# EAGLE design 03_HLT (EAGLE 7.5.0)
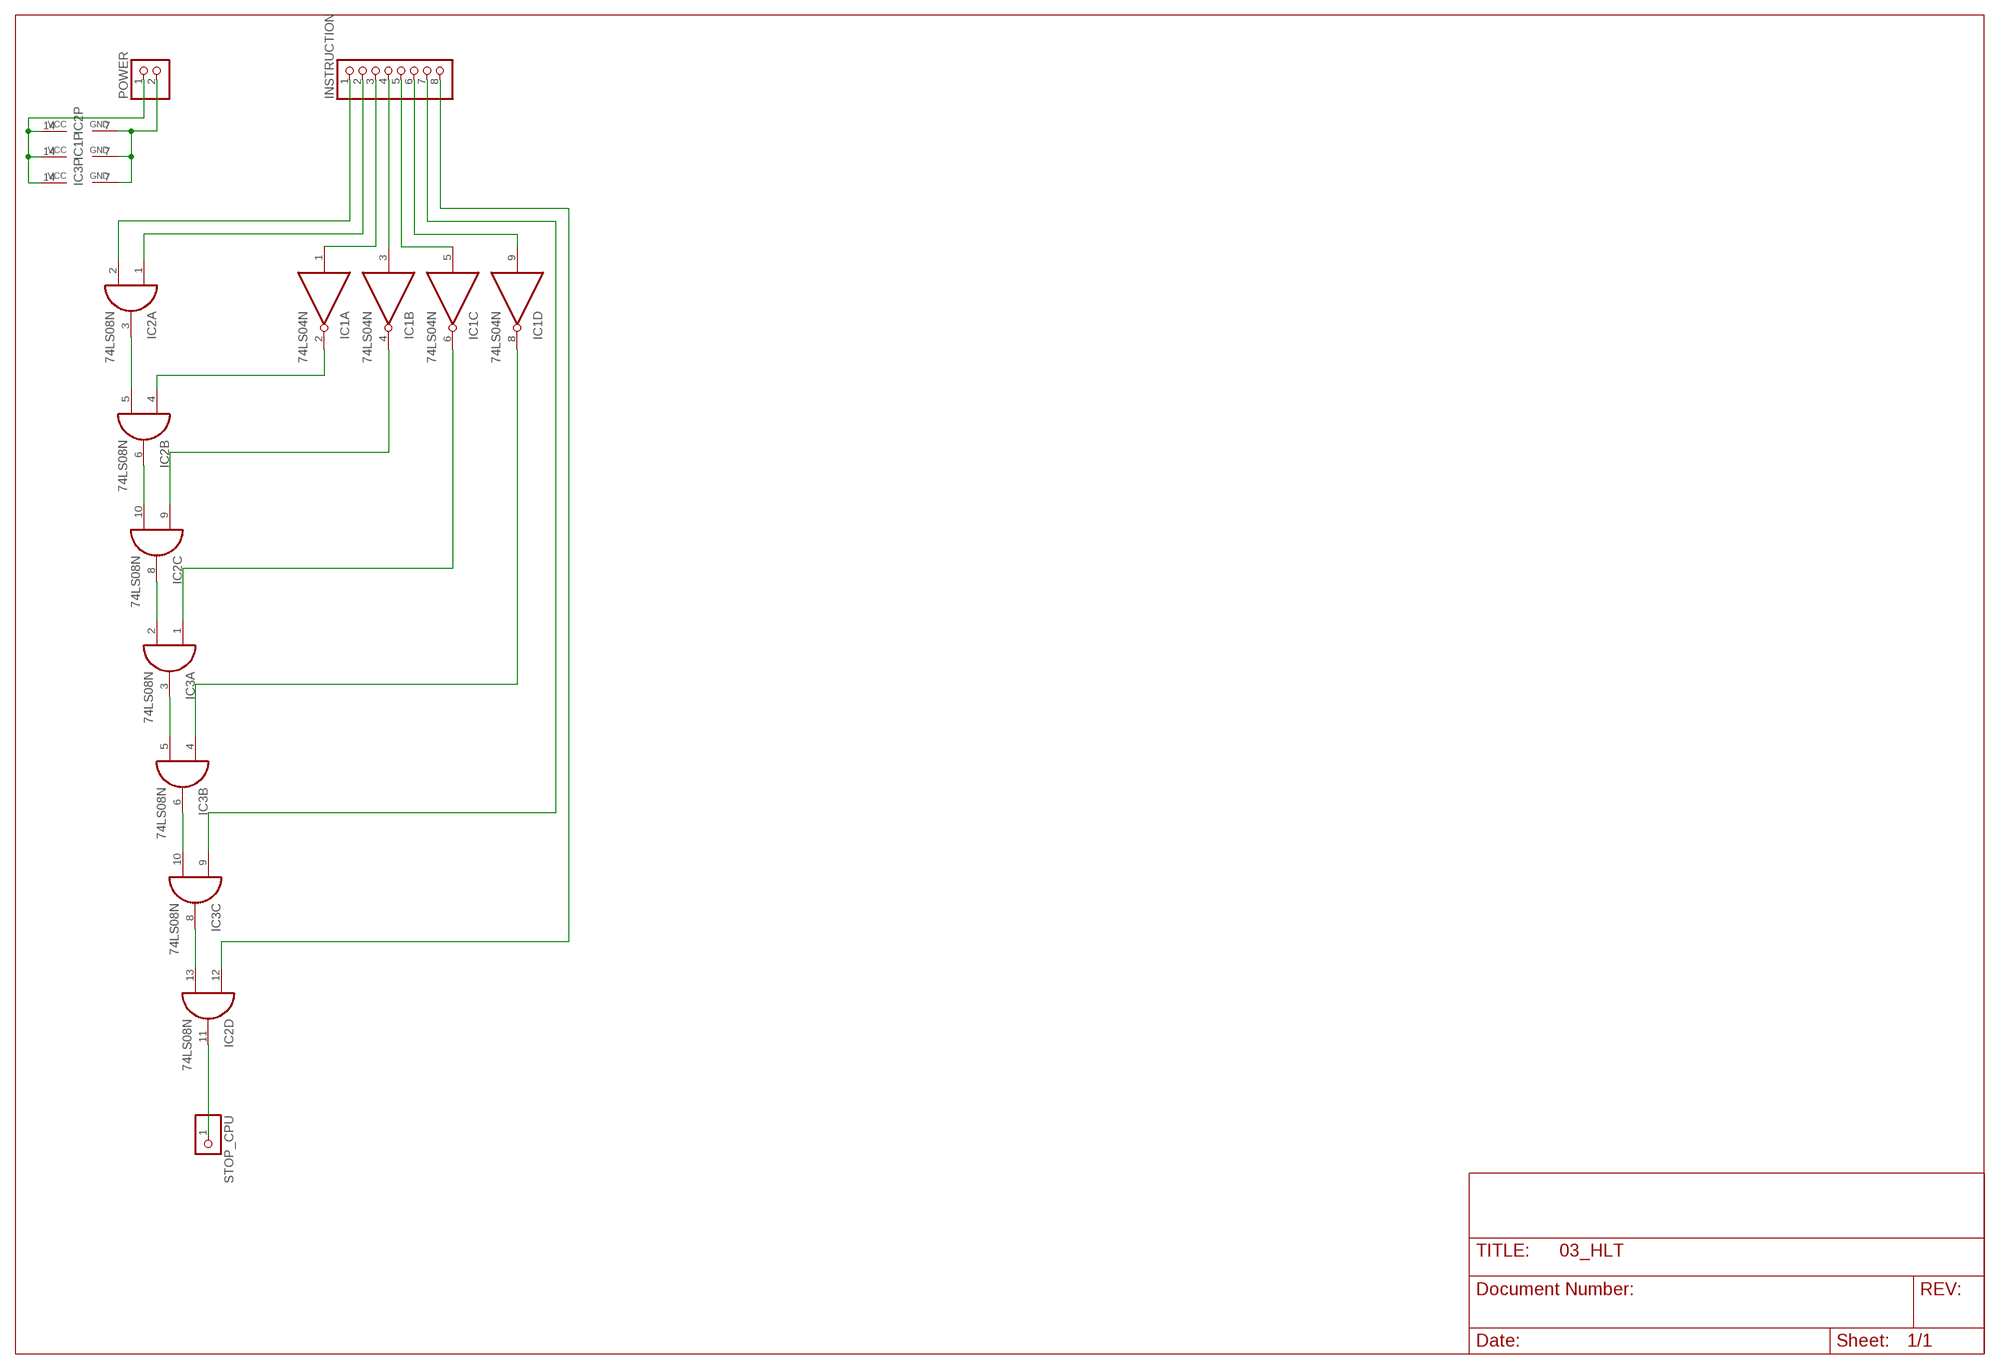
[diagram p0: schematic, sheet 1]

## Parts
IC1  74LS04N  [DIL14]
IC2  74LS08N  [DIL14]
IC3  74LS08N  [DIL14]
INSTRUCTION  PINHD-1X8  [1X08]
POWER  PINHD-1X2  [1X02]
STOP_CPU  PINHD-1X1  [1X01]

## Nets
GND: IC1.7(P:GND) IC2.7(P:GND) IC3.7(P:GND) POWER.2
N$1: IC1.1(A:I) INSTRUCTION.3
N$2: IC1.3(B:I) INSTRUCTION.4
N$3: IC1.5(C:I) INSTRUCTION.5
N$4: IC1.9(D:I) INSTRUCTION.6
N$5: IC2.2(A:I1) INSTRUCTION.1
N$6: IC2.1(A:I0) INSTRUCTION.2
N$7: IC2.3(A:O) IC2.5(B:I1)
N$8: IC1.2(A:O) IC2.4(B:I0)
N$9: IC2.6(B:O) IC2.10(C:I1)
N$10: IC1.4(B:O) IC2.9(C:I0)
N$11: IC2.8(C:O) IC3.2(A:I1)
N$12: IC1.6(C:O) IC3.1(A:I0)
N$13: IC3.3(A:O) IC3.5(B:I1)
N$14: IC1.8(D:O) IC3.4(B:I0)
N$15: IC3.6(B:O) IC3.10(C:I1)
N$16: IC3.9(C:I0) INSTRUCTION.7
N$17: IC2.13(D:I1) IC3.8(C:O)
N$18: IC2.12(D:I0) INSTRUCTION.8
N$19: IC2.11(D:O) STOP_CPU.1
VCC: IC1.14(P:VCC) IC2.14(P:VCC) IC3.14(P:VCC) POWER.1
Unconnected: IC1.10(E:O) IC1.11(E:I) IC1.12(F:O) IC1.13(F:I) IC3.11(D:O) IC3.12(D:I0) IC3.13(D:I1)

## Library data of the parts
IC1 = 74xx-eu:74*04: Hex INVERTER
IC2 IC3 = 74xx-eu:74*08: Quad 2-input AND gate
INSTRUCTION = pinhead:PINHD-1X8: PIN HEADER
POWER = pinhead:PINHD-1X2: PIN HEADER
STOP_CPU = pinhead:PINHD-1X1: PIN HEADER

## Board
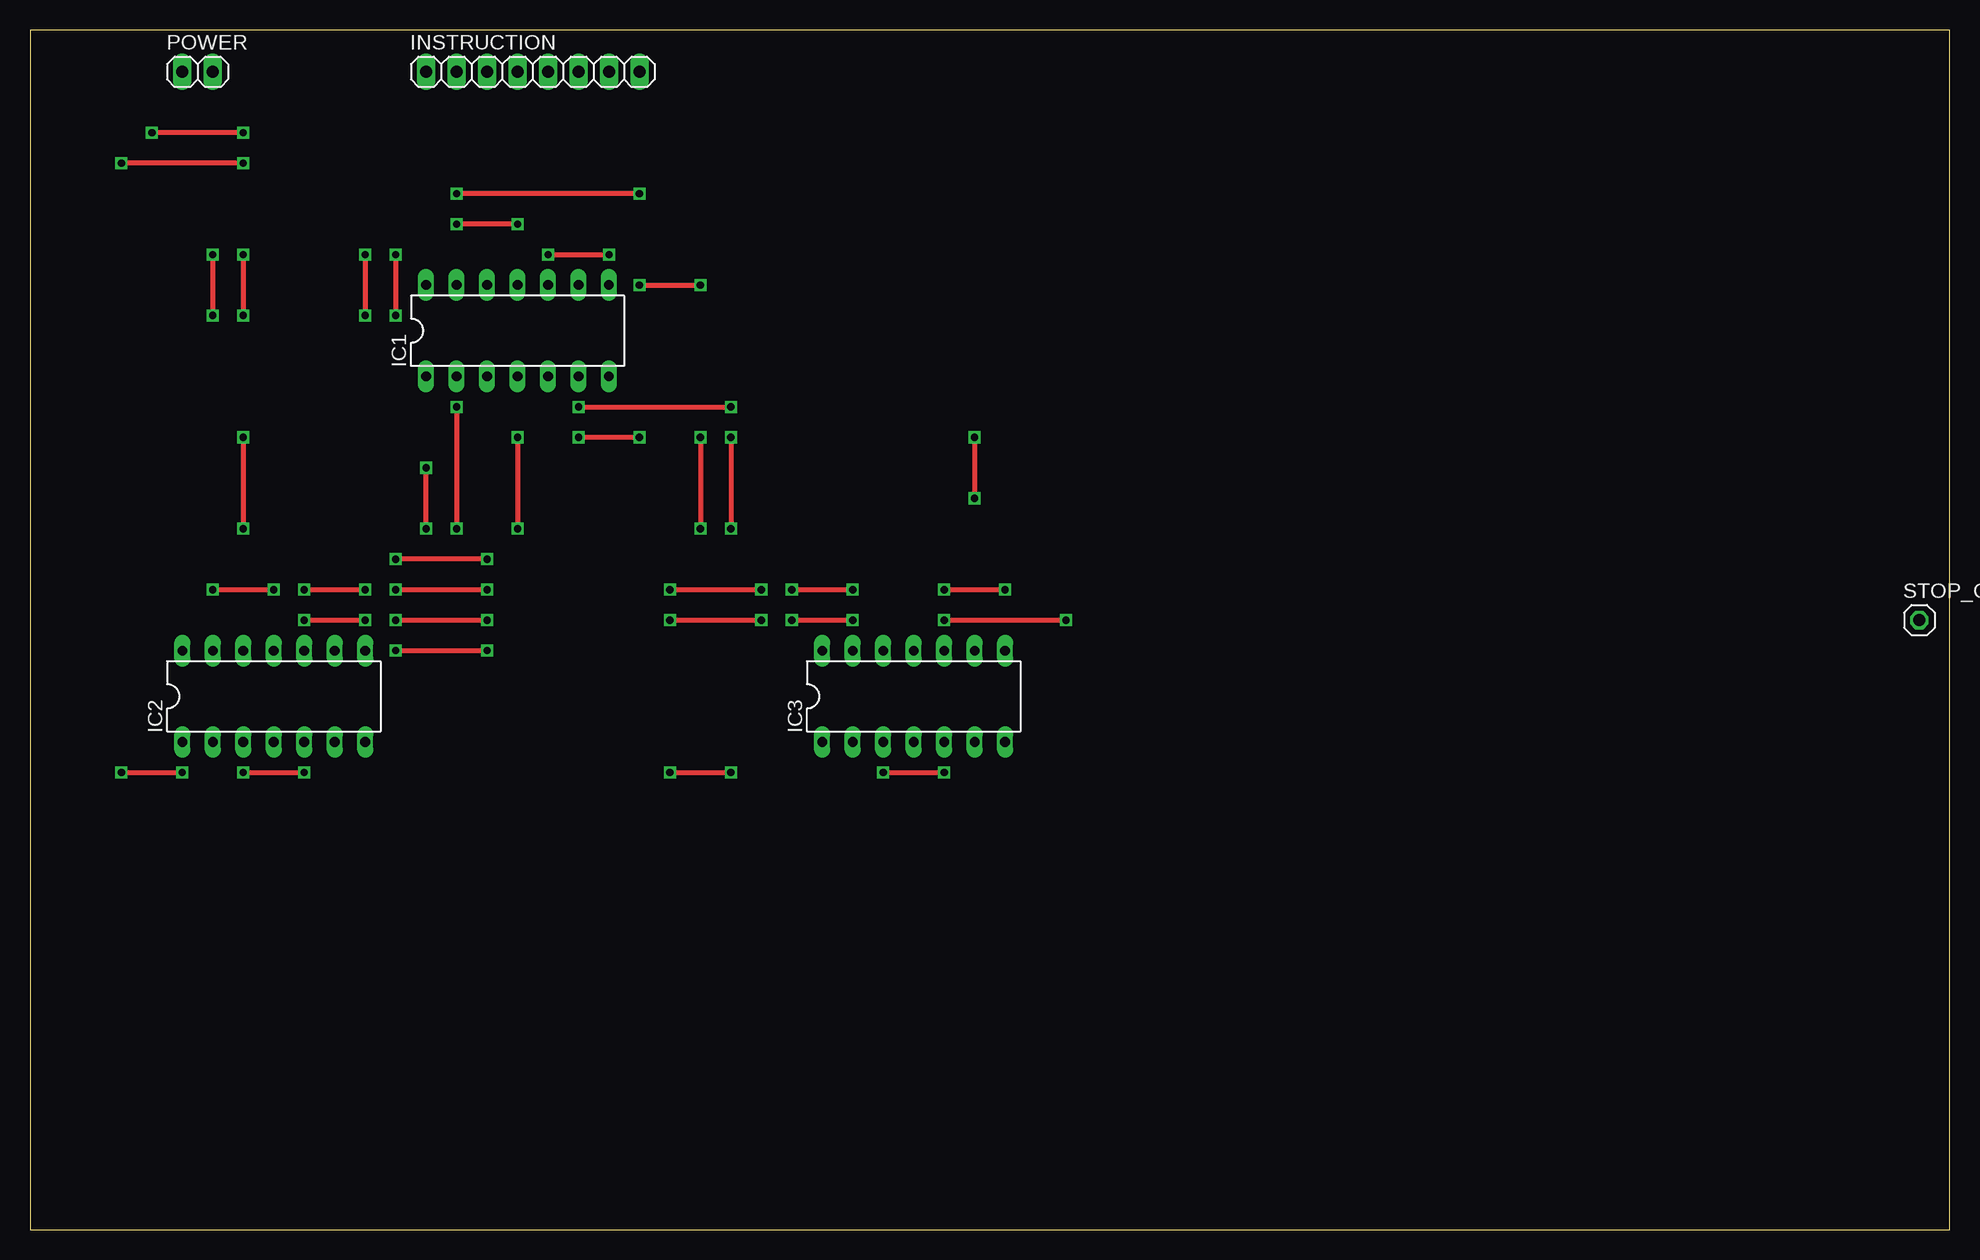
[diagram p1: board, top side]
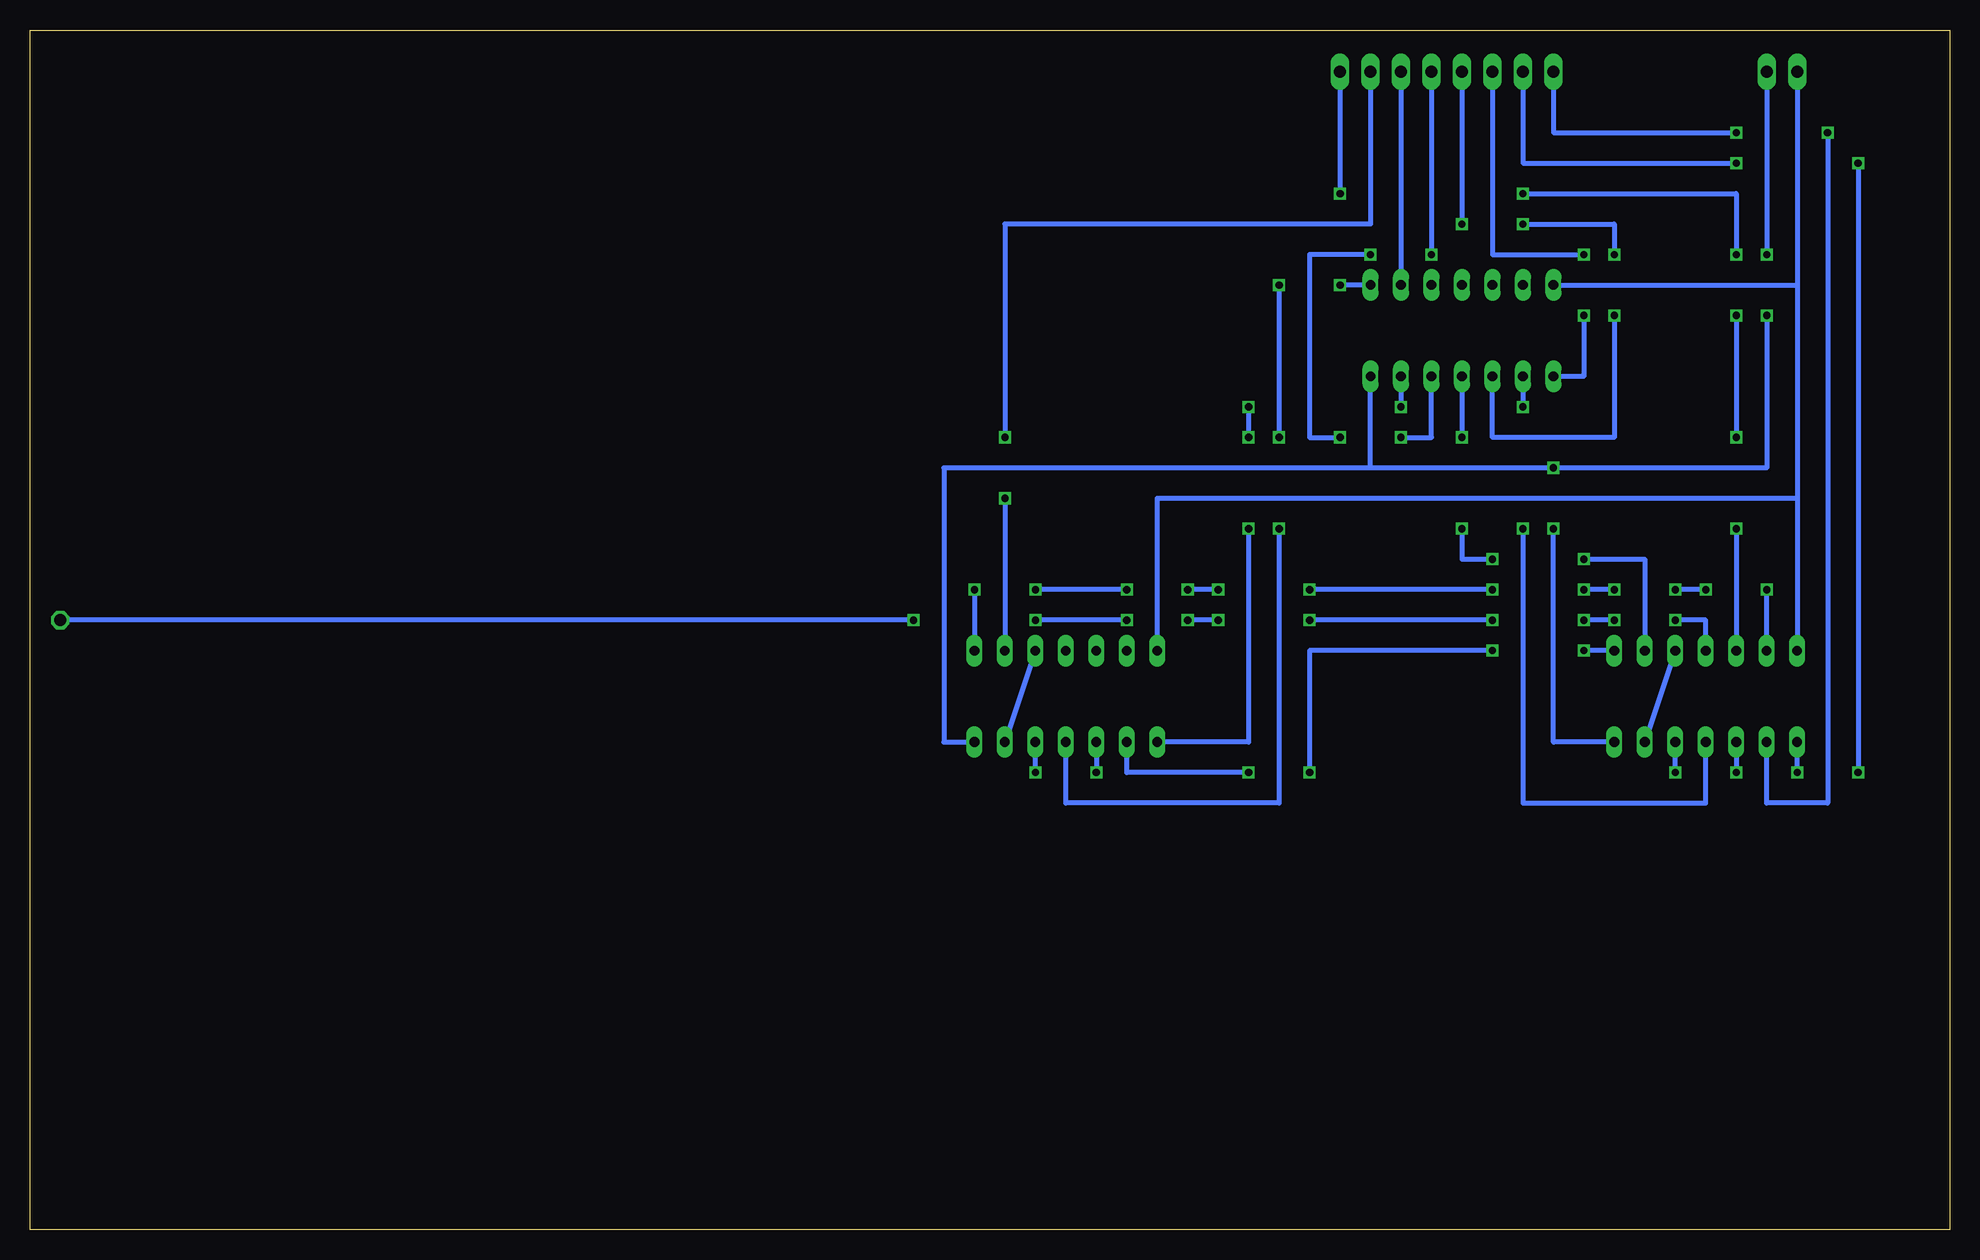
[diagram p2: board, bottom side, seen from below]

Size 160 x 100 mm. Coordinates in mm from the lower left corner, seen from the top.
Outline: 0,0 160,0 160,100 0,100 0,0
Copper layers (1*16): Top 0.035mm / dielectric 1.5mm / Bottom 0.035mm
Design rules "default": minimum track width 10mil, minimum drill 24mil, track to track 8mil, track to pad 8mil, pad to pad 8mil, via to via 8mil, smd to smd 8mil, copper to edge 40mil, drill to drill 8mil, minimum pad ring 10mil, minimum via ring 8mil, stop-mask expansion 4mil, vias tented up to drill 0mil, thermal gap 10mil

### Footprints (pad centres in the part's own frame; a part is rotated, then mirrored left to right if it is on the bottom)
DIL14 = drill 0.813 long: 1 -7.62,-3.81; 2 -5.08,-3.81; 3 -2.54,-3.81; 4 0,-3.81; 5 2.54,-3.81; 6 5.08,-3.81; 7 7.62,-3.81; 8 7.62,3.81; 9 5.08,3.81; 10 2.54,3.81; 11 0,3.81; 12 -2.54,3.81; 13 -5.08,3.81; 14 -7.62,3.81
1X08 = drill 1.016 long: 1 -8.89,0; 2 -6.35,0; 3 -3.81,0; 4 -1.27,0; 5 1.27,0; 6 3.81,0; 7 6.35,0; 8 8.89,0
1X02 = drill 1.016 long: 1 -1.27,0; 2 1.27,0
1X01 = drill 1.016 octagon: 1 0,0

### Placement (x,y rotation side)
IC1  40.64,74.93 0 top
IC2  20.32,44.45 0 top
IC3  73.66,44.45 0 top
INSTRUCTION  41.91,96.52 0 top
POWER  13.97,96.52 0 top
STOP_CPU  157.48,50.8 0 top

### Tracks (layer width: path | path; a pad name or v marks a point on that pad's centre or on a via)
GND  (via drill 0.6)
  Top 0.406: v15.24,81.28 v15.24,76.2 | v33.02,58.42 v33.02,63.5
  Bottom 0.406: POWER.2 v15.24,81.28 | v15.24,76.2 15.24,63.5 v33.02,63.5 48.26,63.5 | 48.26,63.5 IC1.7 | 48.26,63.5 83.82,63.5 83.82,40.64 IC3.7 | IC2.7 33.02,40.64 v33.02,58.42
N$1  (via drill 0.6)
  Top 0.406: v30.48,81.28 v30.48,76.2
  Bottom 0.406: INSTRUCTION.3 38.1,81.28 v30.48,81.28 | v30.48,76.2 30.48,71.12 IC1.1
N$2  (via drill 0.6)
  Top 0.406: v40.64,83.82 v35.56,83.82 | v27.94,81.28 v27.94,76.2
  Bottom 0.406: INSTRUCTION.4 v40.64,83.82 | v35.56,83.82 27.94,83.82 v27.94,81.28 | v27.94,76.2 27.94,66.04 38.1,66.04 IC1.3
N$3  (via drill 0.6)
  Top 0.406: v43.18,81.28 v48.26,81.28 | v50.8,66.04 v45.72,66.04
  Bottom 0.406: INSTRUCTION.5 v43.18,81.28 | v48.26,81.28 53.34,81.28 53.34,66.04 v50.8,66.04 | v45.72,66.04 43.18,66.04 IC1.5
N$4
  Bottom 0.406: INSTRUCTION.6 IC1.9
N$5  (via drill 0.6)
  Top 0.406: v17.78,91.44 v10.16,91.44
  Bottom 0.406: INSTRUCTION.1 33.02,91.44 v17.78,91.44 | v10.16,91.44 10.16,35.56 15.24,35.56 IC2.2
N$6  (via drill 0.6)
  Top 0.406: v17.78,88.9 v7.62,88.9 | v7.62,38.1 v12.7,38.1
  Bottom 0.406: INSTRUCTION.2 35.56,88.9 v17.78,88.9 | v7.62,88.9 v7.62,38.1 | v12.7,38.1 IC2.1
N$7  (via drill 0.6)
  Top 0.406: v17.78,38.1 v22.86,38.1
  Bottom 0.406: IC2.3 v17.78,38.1 | v22.86,38.1 IC2.5
N$8  (via drill 0.6)
  Top 0.406: v35.56,68.58 v35.56,58.42
  Bottom 0.406: IC1.2 v35.56,68.58 | v35.56,58.42 35.56,35.56 20.32,35.56 IC2.4
N$9
  Bottom 0.406: IC2.10 IC2.6
N$10  (via drill 0.6)
  Top 0.406: v40.64,66.04 v40.64,58.42 | v38.1,55.88 v30.48,55.88
  Bottom 0.406: IC1.4 v40.64,66.04 | v40.64,58.42 40.64,55.88 v38.1,55.88 | v30.48,55.88 25.4,55.88 IC2.9
N$11  (via drill 0.6)
  Top 0.406: v30.48,48.26 v38.1,48.26 | v53.34,38.1 v58.42,38.1
  Bottom 0.406: IC2.8 v30.48,48.26 | v38.1,48.26 53.34,48.26 v53.34,38.1 | v58.42,38.1 68.58,38.1 IC3.2
N$12  (via drill 0.6)
  Top 0.406: v45.72,68.58 v58.42,68.58 | v58.42,66.04 v58.42,58.42
  Bottom 0.406: IC1.6 v45.72,68.58 | v58.42,68.58 v58.42,66.04 | v58.42,58.42 58.42,40.64 IC3.1
N$13  (via drill 0.6)
  Top 0.406: v71.12,38.1 v76.2,38.1
  Bottom 0.406: IC3.3 v71.12,38.1 | v76.2,38.1 IC3.5
N$14  (via drill 0.6)
  Top 0.406: v50.8,78.74 v55.88,78.74 | v55.88,66.04 v55.88,58.42
  Bottom 0.406: IC1.8 v50.8,78.74 | v55.88,78.74 v55.88,66.04 | v55.88,58.42 55.88,35.56 73.66,35.56 IC3.4
N$15
  Bottom 0.406: IC3.10 IC3.6
N$16  (via drill 0.6)
  Top 0.406: v78.74,66.04 v78.74,60.96
  Bottom 0.406: INSTRUCTION.7 48.26,83.82 78.74,83.82 v78.74,66.04 | v78.74,60.96 IC3.9
N$17  (via drill 0.6)
  Top 0.406: v15.24,53.34 v20.32,53.34 | v53.34,53.34 v60.96,53.34 | v63.5,53.34 v68.58,53.34 | v76.2,53.34 v81.28,53.34 | v22.86,53.34 v27.94,53.34 | v30.48,53.34 v38.1,53.34
  Bottom 0.406: IC2.13 v15.24,53.34 | v20.32,53.34 v22.86,53.34 | v38.1,53.34 v53.34,53.34 | v60.96,53.34 v63.5,53.34 | v68.58,53.34 v76.2,53.34 | v81.28,53.34 IC3.8 | v27.94,53.34 v30.48,53.34
N$18  (via drill 0.6)
  Top 0.406: v50.8,86.36 v35.56,86.36 | v17.78,81.28 v17.78,76.2 | v17.78,66.04 v17.78,58.42
  Bottom 0.406: INSTRUCTION.8 v50.8,86.36 | v35.56,86.36 17.78,86.36 v17.78,81.28 | v17.78,76.2 v17.78,66.04 | v17.78,58.42 IC2.12
N$19  (via drill 0.6)
  Top 0.406: v53.34,50.8 v60.96,50.8 | v63.5,50.8 v68.58,50.8 | v76.2,50.8 v86.36,50.8 | v22.86,50.8 v27.94,50.8 | v30.48,50.8 v38.1,50.8
  Bottom 0.406: IC2.11 20.32,50.8 v22.86,50.8 | v60.96,50.8 v63.5,50.8 | v68.58,50.8 v76.2,50.8 | v86.36,50.8 STOP_CPU.1 | v27.94,50.8 v30.48,50.8 | v38.1,50.8 v53.34,50.8
VCC
  Bottom 0.406: POWER.1 12.7,78.74 | 12.7,78.74 12.7,60.96 | 12.7,60.96 IC2.14 | IC3.14 66.04,60.96 12.7,60.96 | IC1.14 12.7,78.74